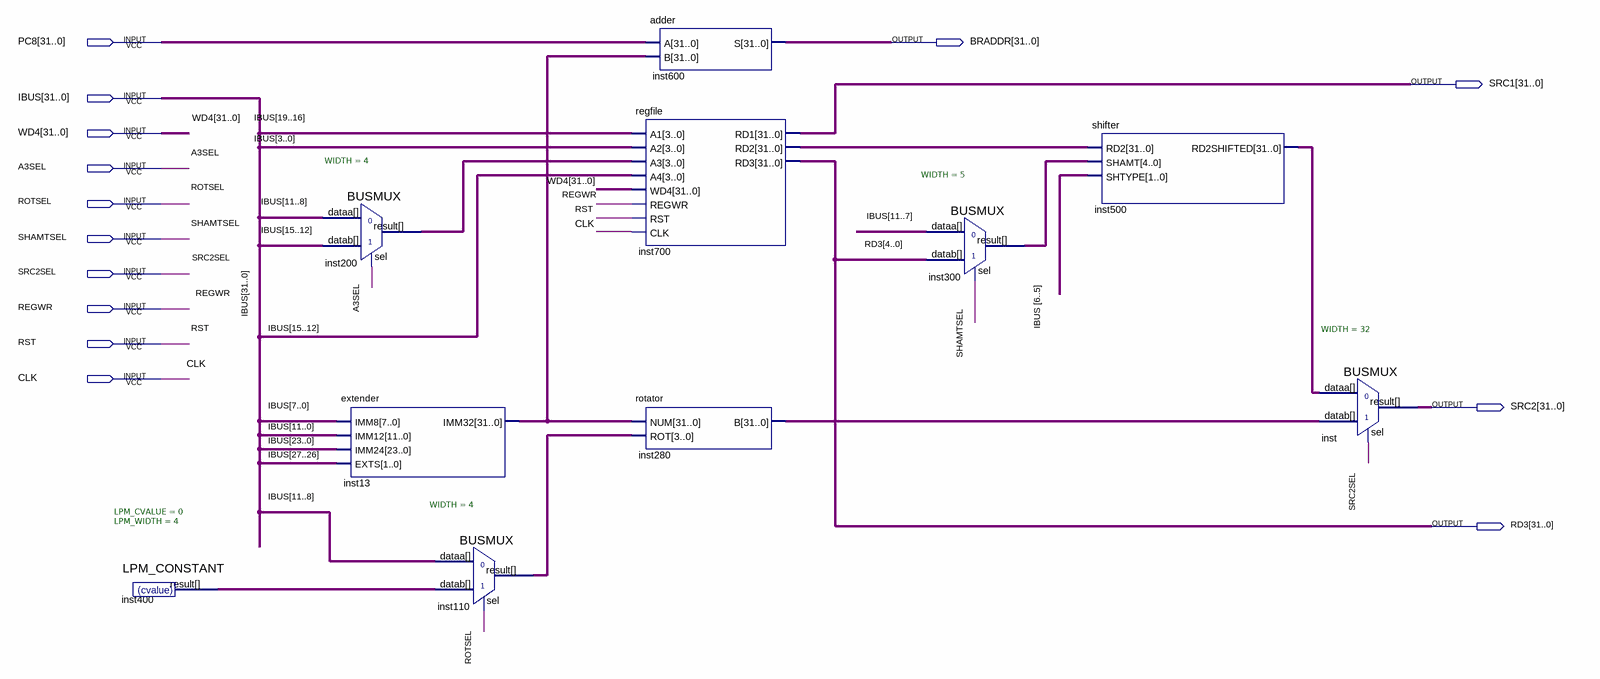
[diagram p0: schematic sheet]
// Quartus schematic decode.bdf as structural Verilog: 10 symbols, 14 pins
module decode (
  input  [31:0] PC8,
  input  [31:0] IBUS,
  input  [31:0] WD4,
  input  A3SEL,
  input  ROTSEL,
  input  SHAMTSEL,
  input  SRC2SEL,
  input  REGWR,
  input  RST,
  input  CLK,
  output [31:0] BRADDR,
  output [31:0] SRC1,
  output [31:0] SRC2,
  output [31:0] RD3
);

  wire [3:0] inst110_result, inst200_result, inst400_result;
  wire [4:0] inst300_result;
  wire [31:0] inst13_imm32, inst280_b, inst500_rd2shifted, inst700_rd2;

  LPM_CONSTANT #(.LPM_CVALUE(0), .LPM_WIDTH(4)) inst400 (.result(inst400_result));
  BUSMUX #(.WIDTH(4)) inst200 (.datab(IBUS[15:12]), .sel(A3SEL), .dataa(IBUS[11:8]), .result(inst200_result));
  extender inst13 (.IMM8(IBUS[7:0]), .IMM12(IBUS[11:0]), .IMM24(IBUS[23:0]), .EXTS(IBUS[27:26]), .IMM32(inst13_imm32));
  BUSMUX #(.WIDTH(4)) inst110 (.datab(inst400_result), .sel(ROTSEL), .dataa(IBUS[11:8]), .result(inst110_result));
  adder inst600 (.A(PC8), .B(inst13_imm32), .S(BRADDR));
  regfile inst700 (
    .A1(IBUS[19:16]), .A2(IBUS[3:0]), .A3(inst200_result), .A4(IBUS[15:12]), .WD4(WD4), .REGWR(REGWR),
    .RST(RST), .CLK(CLK), .RD1(SRC1), .RD2(inst700_rd2), .RD3(RD3));
  rotator inst280 (.NUM(inst13_imm32), .ROT(inst110_result), .B(inst280_b));
  BUSMUX #(.WIDTH(5)) inst300 (.datab(RD3[4:0]), .sel(SHAMTSEL), .dataa(IBUS[11:7]), .result(inst300_result));
  shifter inst500 (.RD2(inst700_rd2), .SHAMT(inst300_result), .SHTYPE(IBUS[6:5]), .RD2SHIFTED(inst500_rd2shifted));
  BUSMUX #(.WIDTH(32)) inst (.datab(inst280_b), .sel(SRC2SEL), .dataa(inst500_rd2shifted), .result(SRC2));
endmodule
